# Altium schematic sheet eMMC_SD.SchDoc
size A4; SheetNumber: 1; SheetTotal: 1
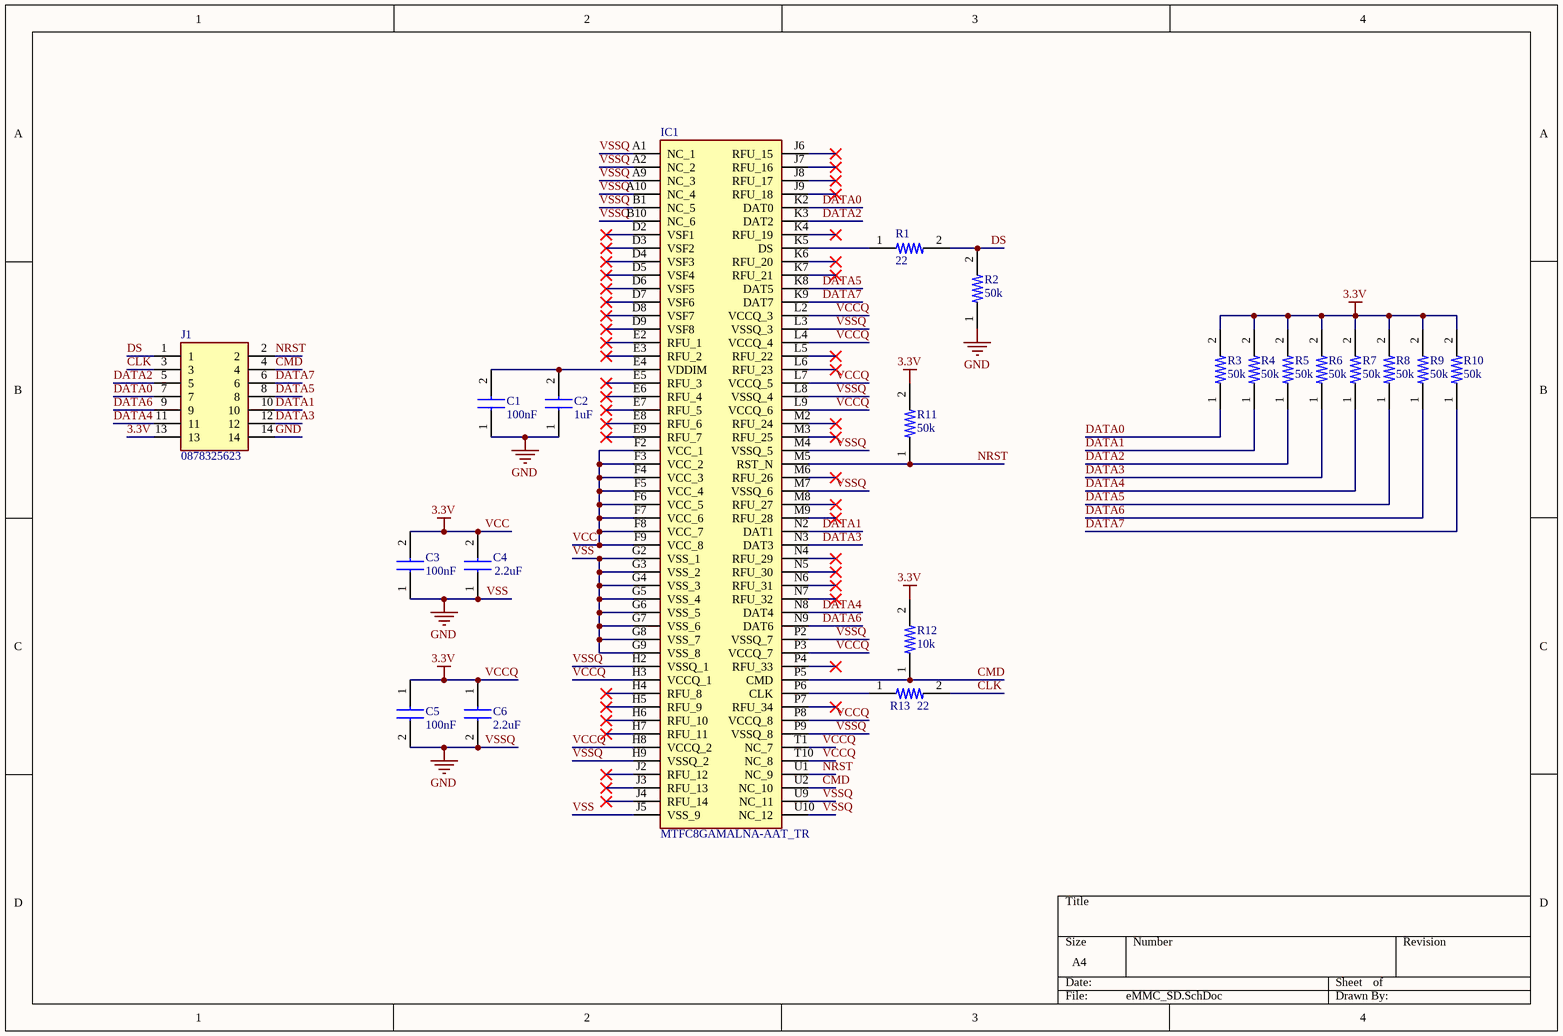
[diagram p0: eMMC_SD.SchDoc]

## Parts
C1  100nF  [CAPC2012X140N]
C2  1uF  [CAPC2012X140N]
C3  100nF  [CAPC2012X140N]
C4  2.2uF  [CAPC2012X140N]
C5  100nF  [CAPC2012X140N]
C6  2.2uF  [CAPC2012X140N]
IC1  MTFC8GAMALNA-AAT_TR  [BGA100C100P10X17_1400X1800X120]
J1  0878325623  [0878325623]
R1  22  [RESC2012X60N]
R2  50k  [RESC2012X60N]
R3  50k  [RESC2012X60N]
R4  50k  [RESC2012X60N]
R5  50k  [RESC2012X60N]
R6  50k  [RESC2012X60N]
R7  50k  [RESC2012X60N]
R8  50k  [RESC2012X60N]
R9  50k  [RESC2012X60N]
R10  50k  [RESC2012X60N]
R11  50k  [RESC2012X60N]
R12  10k  [RESC2012X60N]
R13  22  [RESC2012X60N]

## Nets
3.3V: C3.2 C4.2 C5.1 C6.1 IC1.F2(VCC_1) IC1.F3(VCC_2) IC1.F4(VCC_3) IC1.F5(VCC_4) IC1.F6(VCC_5) IC1.F7(VCC_6) IC1.F8(VCC_7) IC1.F9(VCC_8) IC1.H3(VCCQ_1) IC1.H8(VCCQ_2) IC1.L2(VCCQ_3) IC1.L4(VCCQ_4) IC1.L7(VCCQ_5) IC1.L9(VCCQ_6) IC1.P3(VCCQ_7) IC1.P8(VCCQ_8) IC1.T1(NC_7) IC1.T10(NC_8) J1.13 R3.2 R4.2 R5.2 R6.2 R7.2 R8.2 R9.2 R10.2 R11.2 R12.2  [also labelled VCC, VCCQ]
GND: C1.1 C2.1 C3.1 C4.1 C5.2 C6.2 IC1.A1(NC_1) IC1.A2(NC_2) IC1.A9(NC_3) IC1.A10(NC_4) IC1.B1(NC_5) IC1.B10(NC_6) IC1.G2(VSS_1) IC1.G3(VSS_2) IC1.G4(VSS_3) IC1.G5(VSS_4) IC1.G6(VSS_5) IC1.G7(VSS_6) IC1.G8(VSS_7) IC1.G9(VSS_8) IC1.H2(VSSQ_1) IC1.H9(VSSQ_2) IC1.J5(VSS_9) IC1.L3(VSSQ_3) IC1.L8(VSSQ_4) IC1.M4(VSSQ_5) IC1.M7(VSSQ_6) IC1.P2(VSSQ_7) IC1.P9(VSSQ_8) IC1.U9(NC_11) IC1.U10(NC_12) J1.14 R2.1  [also labelled VSS, VSSQ]
CLK: J1.3 R13.2
CMD: IC1.P5(CMD) IC1.U2(NC_10) J1.4 R12.1
DATA0: IC1.K2(DAT0) J1.7 R3.1
DATA1: IC1.N2(DAT1) J1.10 R4.1
DATA2: IC1.K3(DAT2) J1.5 R5.1
DATA3: IC1.N3(DAT3) J1.12 R6.1
DATA4: IC1.N8(DAT4) J1.11 R7.1
DATA5: IC1.K8(DAT5) J1.8 R8.1
DATA6: IC1.N9(DAT6) J1.9 R9.1
DATA7: IC1.K9(DAT7) J1.6 R10.1
DS: J1.1 R1.2 R2.2
NRST: IC1.M5(RST_N) IC1.U1(NC_9) J1.2 R11.1
NetC1_2: C1.2 C2.2 IC1.E4(VDDIM)
NetIC1_K5: IC1.K5(DS) R1.1
NetIC1_P6: IC1.P6(CLK) R13.1

Not connected (* = marked no-connect by the designer): IC1 D2(VSF1)* D3(VSF2)* D4(VSF3)* D5(VSF4)* D6(VSF5)* D7(VSF6)* D8(VSF7)* D9(VSF8)* E2(RFU_1)* E3(RFU_2)* E5(RFU_3)* E6(RFU_4)* E7(RFU_5)* E8(RFU_6)* E9(RFU_7)* H4(RFU_8)* H5(RFU_9)* H6(RFU_10)* H7(RFU_11)* J2(RFU_12)* J3(RFU_13)* J4(RFU_14)* J6(RFU_15)* J7(RFU_16)* J8(RFU_17)* J9(RFU_18)* K4(RFU_19)* K6(RFU_20)* K7(RFU_21)* L5(RFU_22)* L6(RFU_23)* M2(RFU_24)* M3(RFU_25)* M6(RFU_26)* M8(RFU_27)* M9(RFU_28)* N4(RFU_29)* N5(RFU_30)* N6(RFU_31)* N7(RFU_32)* P4(RFU_33)* P7(RFU_34)*

## Library data of the parts
C1 C3 C5 = CMP-002-000003-1: Capacitor / KAM21BR71H104JT; Manufacturer_Part_Number: 08055C105K4Z2A; Manufacturer_Name: Kyocera AVX; Source: SamacSys.SchLib; Arrow Part Number: 08055C105K4Z2A; Datasheet Link: https://4donline.ihs.com/images/VipMasterIC/IC/AVXC/AVXC-S-A0008637974/AVXC-S-A0008637974-1.pdf?hkey=6D3A4C79FDBF58556ACFDE234799DDF0; Mouser Price/Stock: https://www.mouser.co.uk/ProductDetail/KYOCERA-AVX/08055C105K4Z2A?qs=0%2F2GmT7MRM8qZ4y6WMRpDA%3D%3D; Design Item ID: 08055C105K4Z2A; Mouser Part Number: 581-08055C105K4Z2A; Height: 1.4mm; Arrow Price/Stock: https://www.arrow.com/en/products/08055c105k4z2a/avx
C2 = CMP-002-000003-1: Capacitor / 08055C105K4Z2A; Manufacturer_Name: Kyocera AVX; Source: SamacSys.SchLib; Manufacturer_Part_Number: 08055C105K4Z2A; Arrow Part Number: 08055C105K4Z2A; Datasheet Link: https://4donline.ihs.com/images/VipMasterIC/IC/AVXC/AVXC-S-A0008637974/AVXC-S-A0008637974-1.pdf?hkey=6D3A4C79FDBF58556ACFDE234799DDF0; Mouser Price/Stock: https://www.mouser.co.uk/ProductDetail/KYOCERA-AVX/08055C105K4Z2A?qs=0%2F2GmT7MRM8qZ4y6WMRpDA%3D%3D; Design Item ID: 08055C105K4Z2A; Mouser Part Number: 581-08055C105K4Z2A; Height: 1.4mm; Arrow Price/Stock: https://www.arrow.com/en/products/08055c105k4z2a/avx
C4 C6 = CMP-002-000003-1: Capacitor / C2012X7R1E225K125AB; Manufacturer_Part_Number: 08055C105K4Z2A; Manufacturer_Name: Kyocera AVX; Source: SamacSys.SchLib; Arrow Part Number: 08055C105K4Z2A; Datasheet Link: https://4donline.ihs.com/images/VipMasterIC/IC/AVXC/AVXC-S-A0008637974/AVXC-S-A0008637974-1.pdf?hkey=6D3A4C79FDBF58556ACFDE234799DDF0; Mouser Price/Stock: https://www.mouser.co.uk/ProductDetail/KYOCERA-AVX/08055C105K4Z2A?qs=0%2F2GmT7MRM8qZ4y6WMRpDA%3D%3D; Design Item ID: 08055C105K4Z2A; Mouser Part Number: 581-08055C105K4Z2A; Height: 1.4mm; Arrow Price/Stock: https://www.arrow.com/en/products/08055c105k4z2a/avx
IC1 = CMP-008-000016-1: Multi Media Card Controller and NAND Flash e.MMC Memory; Manufacturer_Part_Number: MTFC8GAMALNA-AAT TR; Manufacturer_Name: Micron; Height: 1.2mm; Datasheet Link: https://kr.mouser.com/datasheet/2/671/micron_technology_mict-s-a0006806196-1-1759129.pdf; Arrow Price/Stock: null?region=nac; Source: SamacSys.SchLib; Mouser Price/Stock: https://www.mouser.co.uk/ProductDetail/Micron/MTFC8GAMALNA-AAT-TR?qs=j%252B1pi9TdxUZjqwVTwshsGQ%3D%3D; Arrow Part Number: MTFC8GAMALNA-AAT TR; Mouser Part Number: 340-354324-REEL; Design Item ID: MTFC8GAMALNA-AAT_TR
J1 = 0878325623: Connector; Manufacturer_Name: Molex; Datasheet Link: https://www.molex.com/pdm_docs/sd/878325623_sd.pdf; Height: 7.8mm; Manufacturer_Part_Number: 0878325623; Mouser Part Number: N/A; Mouser Price/Stock: https://www.mouser.co.uk/ProductDetail/Molex/0878325623?qs=PBcRNPEHKspNHTvfJoTAAA%3D%3D; Arrow Part Number: 0878325623; Arrow Price/Stock: https://www.arrow.com/en/products/0878325623/molex
R1-R13 = CMP-010-000009-4: Resistor; Design Item ID: R 0805 (2012); Source: MotoLibrary.SchLib